# Altium schematic sheet NBT_SPI_MUX.SCHDOC
size A4; Organization: Altium Limited; Address1: L3, 12a Rodborough Rd; Address2: Frenchs Forest; Address3: NSW; Address4: Australia 2086; DocumentNumber: 12; SheetNumber: 12; SheetTotal: 12
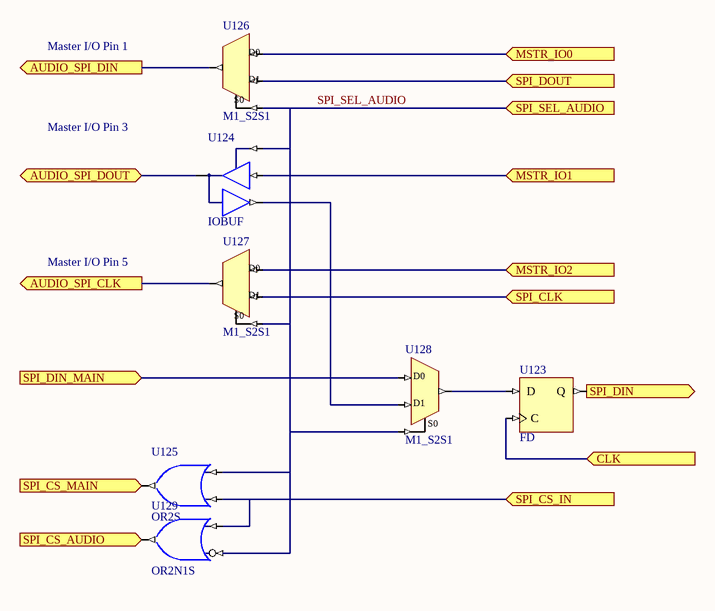
[diagram p0: NBT_SPI_MUX.SCHDOC]

## Parts
U123  FD
U124  IOBUF
U125  OR2S
U126  M1_S2S1
U127  M1_S2S1
U128  M1_S2S1
U129  OR2N1S

## Ports
AUDIO_SPI_CLK (out), AUDIO_SPI_DIN (out), AUDIO_SPI_DOUT (bidir), CLK (in), MSTR_IO0 (in), MSTR_IO1 (in), MSTR_IO2 (in), SPI_CLK (in), SPI_CS_AUDIO (out), SPI_CS_IN (in), SPI_CS_MAIN (out), SPI_DIN (out), SPI_DIN_MAIN (in), SPI_DOUT (in), SPI_SEL_AUDIO (in)

## Nets
AUDIO_SPI_CLK: U127.O ; port AUDIO_SPI_CLK
AUDIO_SPI_DIN: U126.O ; port AUDIO_SPI_DIN
AUDIO_SPI_DOUT: U124.IO ; port AUDIO_SPI_DOUT
CLK: U123.C ; port CLK
MSTR_IO0: U126.D0 ; port MSTR_IO0
MSTR_IO1: U124.I ; port MSTR_IO1
MSTR_IO2: U127.D0 ; port MSTR_IO2
SPI_CLK: U127.D1 ; port SPI_CLK
SPI_CS_AUDIO: U129.O ; port SPI_CS_AUDIO
SPI_CS_IN: U125.I0 U129.I1 ; port SPI_CS_IN
SPI_CS_MAIN: U125.O ; port SPI_CS_MAIN
SPI_DIN: U123.Q ; port SPI_DIN
SPI_DIN_MAIN: U128.D0 ; port SPI_DIN_MAIN
SPI_DOUT: U126.D1 ; port SPI_DOUT
SPI_SEL_AUDIO: U124.T U125.I1 U126.S0 U127.S0 U128.S0 U129.I0 ; port SPI_SEL_AUDIO
NetU123_D: U123.D U128.O
NetU124_O: U124.O U128.D1

## Notes on the sheet
- Master I/O Pin 1
- Master I/O Pin 3
- Master I/O Pin 5
- Title
- Size:
- Date:
- A4
- Number:
- Time:
- Revision:
- Sheet
- of
- File:

## Library data of the parts
U123 = FD: D-Type Flip-Flop; ArchiveName: GENERIC; Published: 18-Dec-2003; Publisher: Altium Limited; Xilinx Equivalent: FD; Core Revision: 1.00.00
U124 = IOBUF: Input/Output Buffer; ArchiveName: GENERIC; Published: 4-Dec-2003; Publisher: Altium Limited; Xilinx Equivalent: IOBUF; Core Revision: 1.00.00
U125 = OR2S: 2-Input OR Gate, Single Pin Version; Xilinx Equivalent: OR2; ArchiveName: GENERIC; Published: 4-Dec-2003; Publisher: Altium Limited; Core Revision: 1.00.00
U126-U128 = M1_S2S1: 2x1-Single Wire to 1x1-Single Wire Multiplexer; Xilinx Equivalent: M2_1; ArchiveName: GENERIC; Published: 4-Dec-2003; Publisher: Altium Limited; Core Revision: 1.00.00
U129 = OR2N1S: 2-Input OR Gate with Active Low A Input, Single Pin Version; Xilinx Equivalent: OR2B1; ArchiveName: GENERIC; Published: 4-Dec-2003; Publisher: Altium Limited; Core Revision: 1.00.00